# Altium schematic sheet vers1.0.SchDoc
size A4 portrait
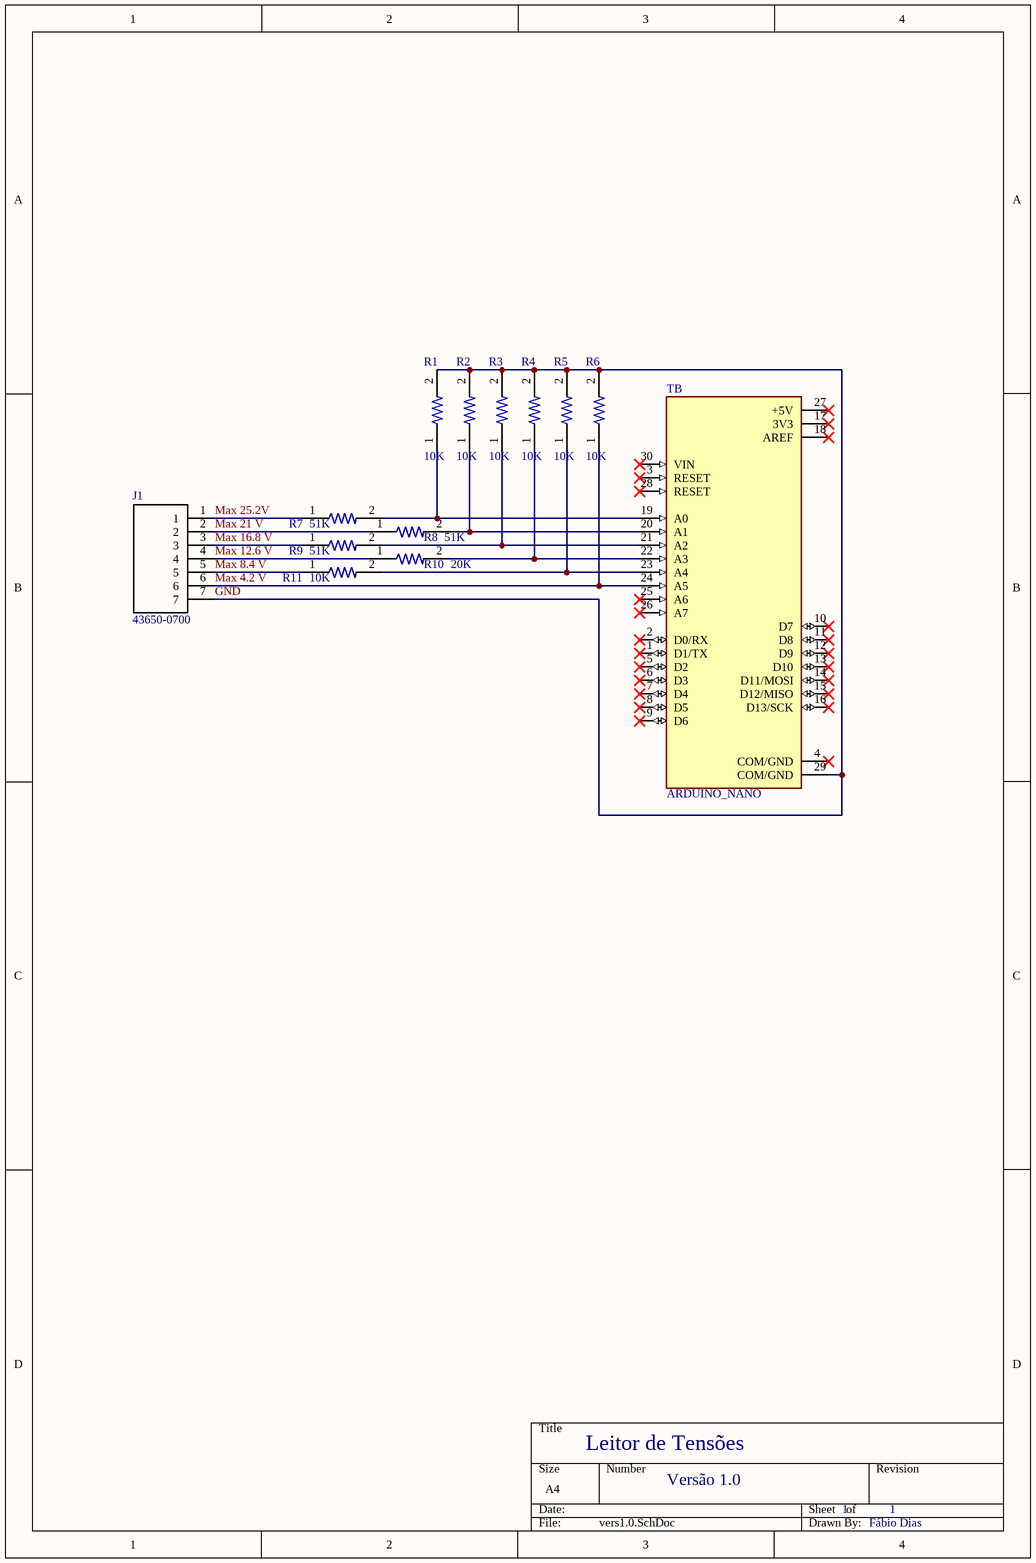
[diagram p0: vers1.0.SchDoc]

## Parts
J1  43650-0700  [43650-07YY_R]
R1  10K  [R 0201]
R2  10K  [R 0201]
R3  10K  [R 0201]
R4  10K  [R 0201]
R5  10K  [R 0201]
R6  10K  [R 0201]
R7  51K  [R 0201]
R8  51K  [R 0201]
R9  51K  [R 0201]
R10  20K  [R 0201]
R11  10K  [R 0201]
TB  ARDUINO_NANO  [SHIELD_ARDUINO_NANO]

## Nets
GND: J1.7 R1.2 R2.2 R3.2 R4.2 R5.2 R6.2 TB.29(COM/GND)
Max 4.2 V: J1.6 R6.1 TB.24(A5)
Max 8.4 V: J1.5 R11.1
Max 12.6 V: J1.4 R10.1
Max 16.8 V: J1.3 R9.1
Max 21 V: J1.2 R8.1
Max 25.2V: J1.1 R7.1
NetR1_1: R1.1 R7.2 TB.19(A0)
NetR2_1: R2.1 R8.2 TB.20(A1)
NetR3_1: R3.1 R9.2 TB.21(A2)
NetR4_1: R4.1 R10.2 TB.22(A3)
NetR5_1: R5.1 R11.2 TB.23(A4)

Not connected (* = marked no-connect by the designer): TB 1(D1/TX)* 2(D0/RX)* 3(RESET)* 4(COM/GND)* 5(D2)* 6(D3)* 7(D4)* 8(D5)* 9(D6)* 10(D7)* 11(D8)* 12(D9)* 13(D10)* 14(D11/MOSI)* 15(D12/MISO)* 16(D13/SCK)* 17(3V3)* 18(AREF)* 25(A6)* 26(A7)* 27(+5V)* 28(RESET)* 30(VIN)*

## Notes on the sheet
- Leitor de Tensões
- Versão 1.0
- 1
- Fábio Dias

## Library data of the parts
J1 = 43650-0700: Connector; Manufacturer_Name: Molex; Datasheet Link: https://www.molex.com/pdm_docs/sd/436500200_sd.pdf; Height: 5.57mm; Manufacturer_Part_Number: 43650-0700; Mouser Part Number: 538-43650-0700; Mouser Price/Stock: https://www.mouser.co.uk/ProductDetail/Molex/43650-0700?qs=V1dpogj8xu8fQ1Wfvx7ltg%3D%3D
R1-R11 = Resistencia
TB = ARDUINO_NANO: ATSAMD21G18A Arduino Nano 33 IoT SAM D ARMÂ® CortexÂ®-M0+ MCU 32-Bit Embedded Evaluation Board; MP: ARDUINO NANO; Package: None; Price: None; Availability: Unavailable; Value: *; MF: Arduino; SnapEDA_Link: https://www.snapeda.com/parts/ARDUINO%20NANO/Arduino/view-part/1128261/?ref=snap